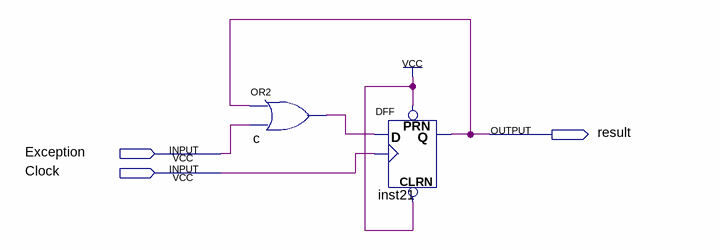
[diagram p0: schematic sheet]
// Quartus schematic testetolete.bdf as structural Verilog: 2 symbols, 3 pins
module testetolete (
  input  Exception,
  input  Clock,
  output result
);

  wire c_out;

  or c (c_out, result, Exception);
  DFF inst21 (.CLRN(1'b1), .CLK(Clock), .D(c_out), .PRN(1'b1), .Q(result));
endmodule
